# EAGLE board 85-2031 (EAGLE 6.6.0), part 1 of 2
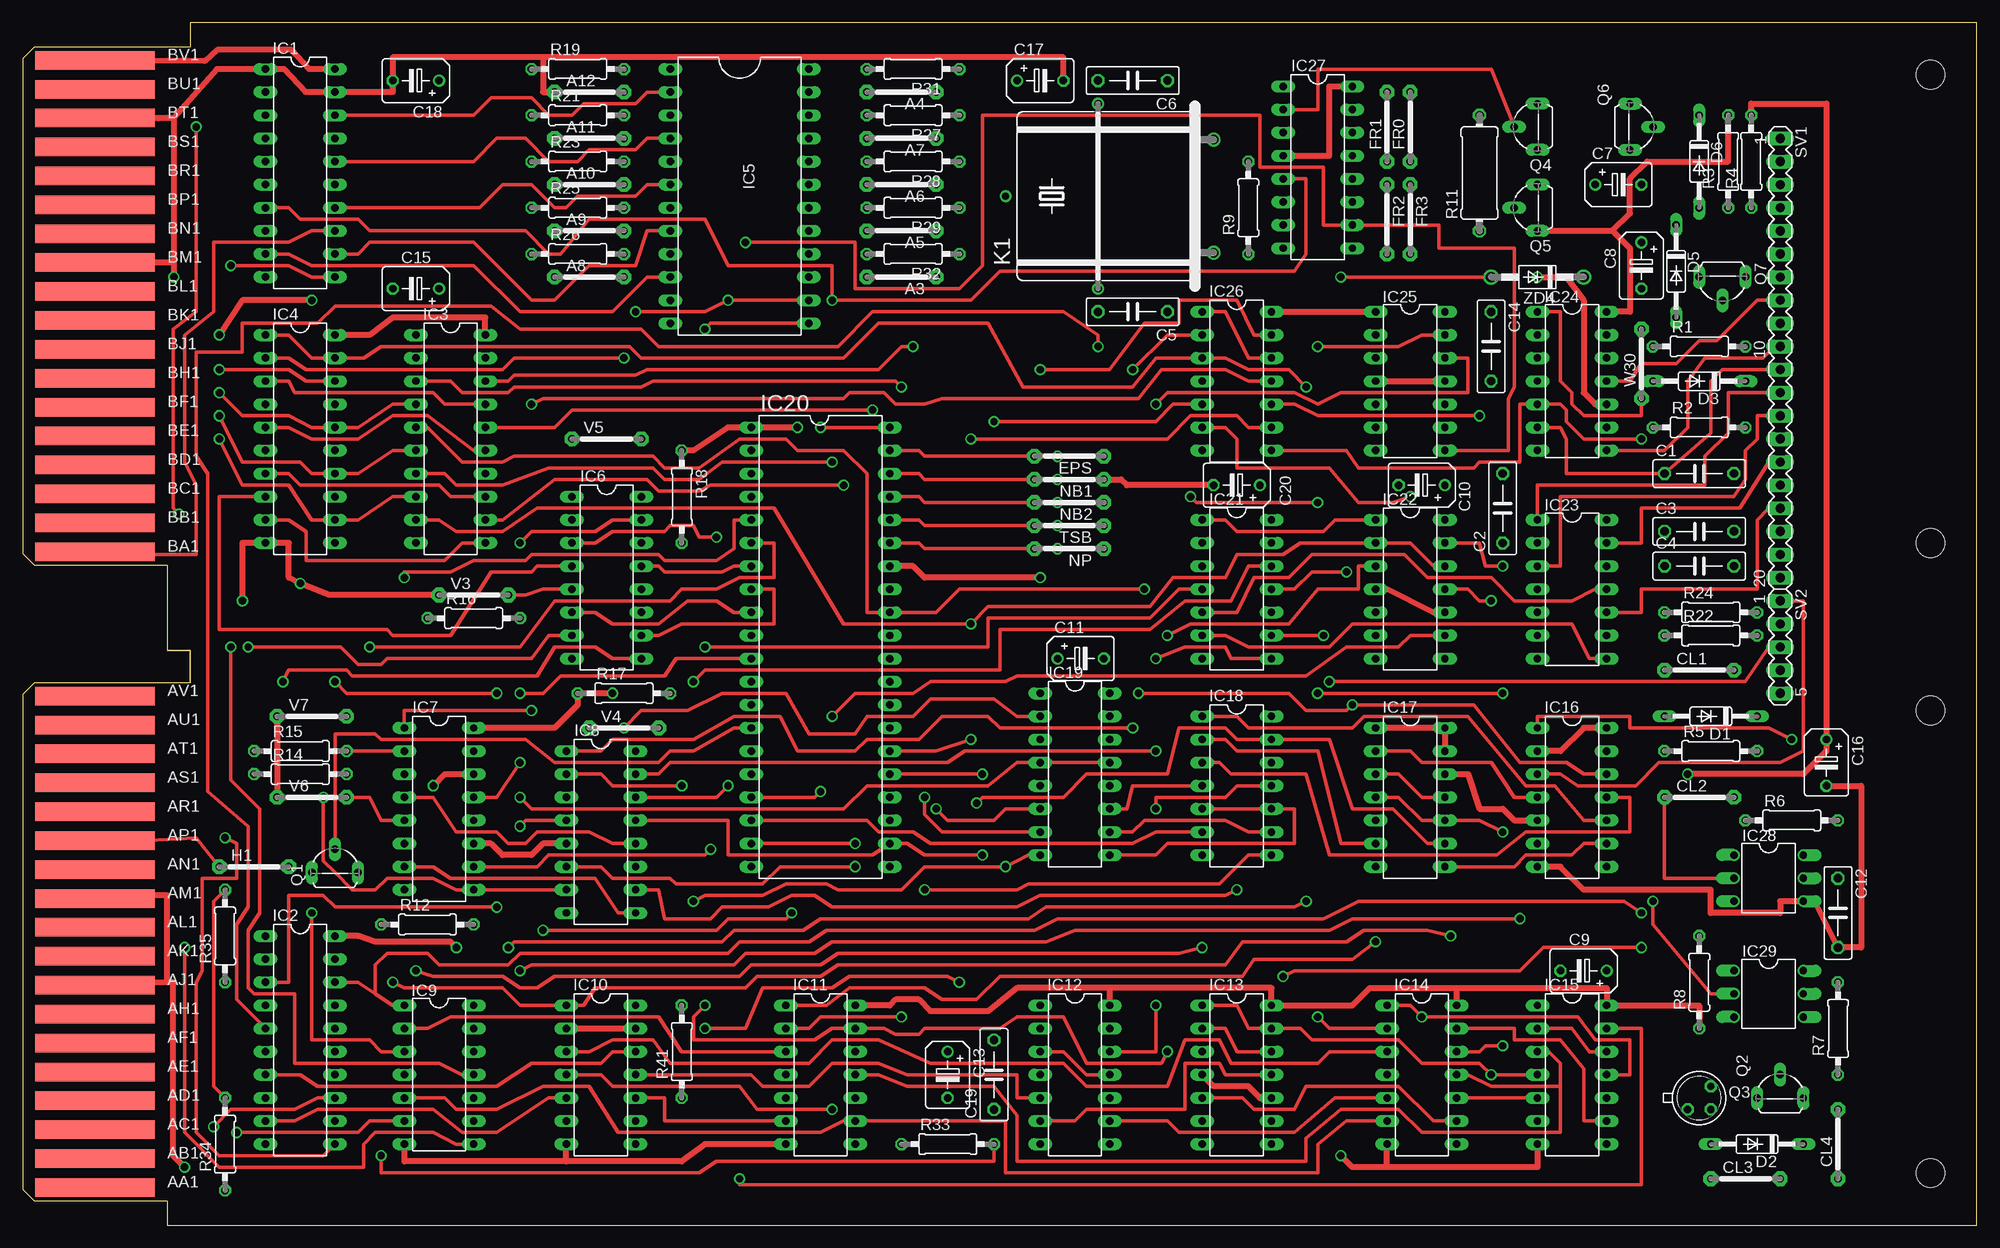
[diagram p2: board, top side]
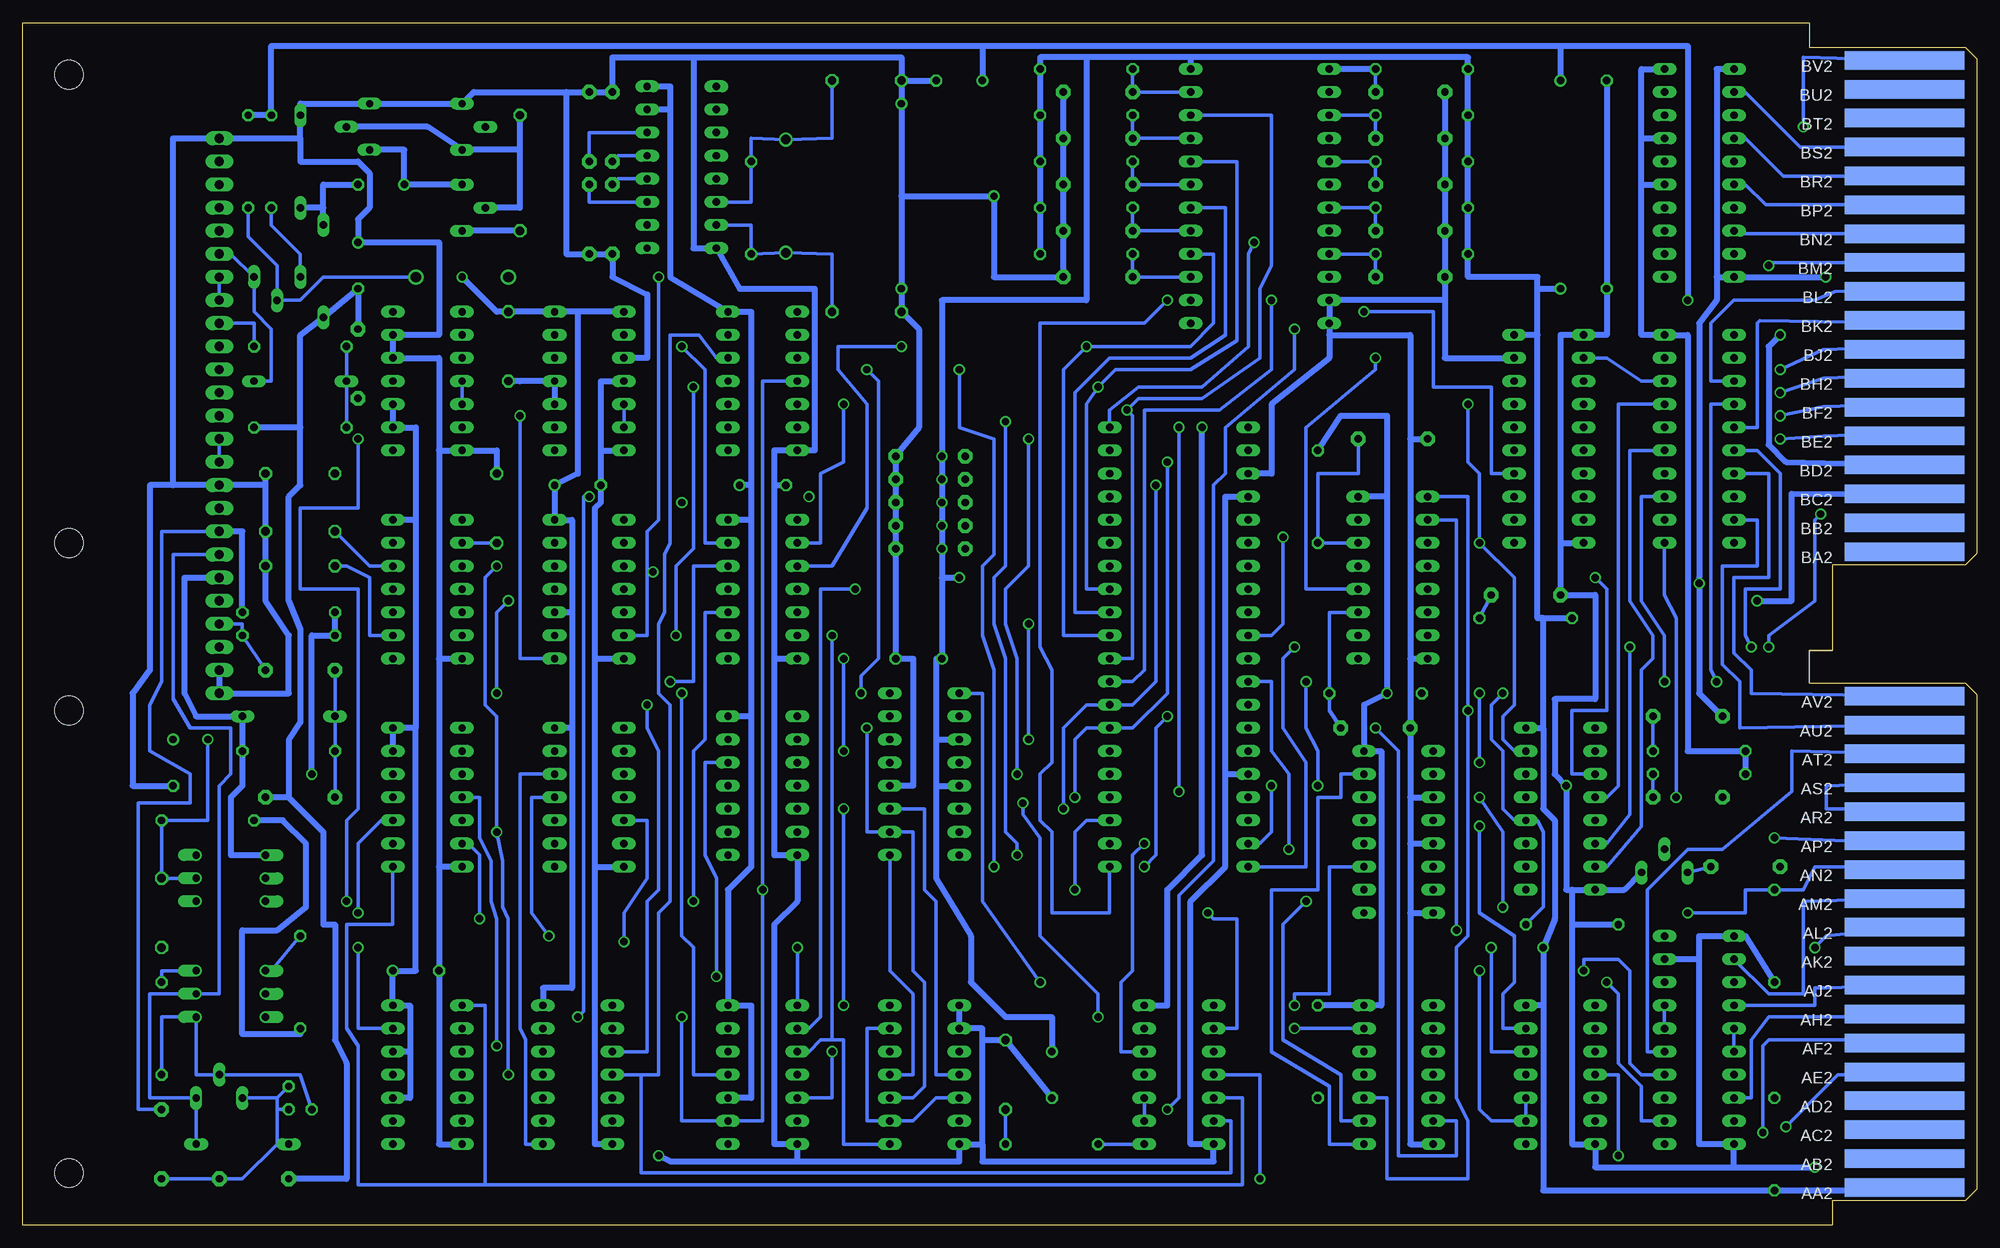
[diagram p3: board, bottom side, seen from below]

Size 214.63 x 132.08 mm. Coordinates in mm from the lower left corner, seen from the top.
Copper layers (1+16): Top 0.035mm / dielectric 1.5mm / Bottom 0.035mm
Design rules "16mils": minimum track width 16mil, minimum drill 32mil, track to track 15mil, track to pad 10mil, pad to pad 10mil, via to via 10mil, smd to smd 10mil, copper to edge 13mil, drill to drill 10mil, minimum pad ring 10mil, minimum via ring 8mil, stop-mask expansion 0mil, vias tented up to drill 0mil, thermal gap 10mil
Net classes: 1 Supply: width 0.635 mm

## Footprints (pad centres in the part's own frame; a part is rotated, then mirrored left to right if it is on the bottom)
07 = drill 0.813 pad 1.6 octagon: 1 -3.81,0; 2 3.81,0
C075-032X103 = drill 0.914 octagon: 1 -3.81,0; 2 3.81,0
B45181B = drill 0.813: + -2.54,0 | drill 0.813 octagon: - 2.54,0
DO35-10 = drill 0.813 long: A 5.08,0; C -5.08,0
DOUBLE-LONG = hole 3.175: 209.55,56.515; 209.55,5.715; 209.55,74.93; 209.55,126.365
EDGE-CON4 = smd 13.106 x 2.032: AA1 7.938,4.128; AB1 7.938,7.303; AC1 7.938,10.477; AD1 7.938,13.652; AE1 7.938,16.828; AF1 7.938,20.003; AH1 7.938,23.177; AJ1 7.938,26.352; AK1 7.938,29.527; AL1 7.938,32.703; AM1 7.938,35.877; AN1 7.938,39.053; AP1 7.938,42.227; AR1 7.938,45.403; AS1 7.938,48.578; AT1 7.938,51.752; AU1 7.938,54.928; AV1 7.938,58.102; BA1 7.938,73.978; BB1 7.938,77.153; BC1 7.938,80.328; BD1 7.938,83.502; BE1 7.938,86.677; BF1 7.938,89.853; BH1 7.938,93.028; BJ1 7.938,96.203; BK1 7.938,99.377; BL1 7.938,102.552; BM1 7.938,105.728; BN1 7.938,108.903; BP1 7.938,112.078; BR1 7.938,115.252; BS1 7.938,118.427; BT1 7.938,121.603; BU1 7.938,124.778; BV1 7.938,127.953 | smd 13.106 x 2.032 bottom: AA2 7.938,4.128; AB2 7.938,7.303; AC2 7.938,10.477; AD2 7.938,13.652; AE2 7.938,16.828; AF2 7.938,20.003; AH2 7.938,23.177; AJ2 7.938,26.352; AK2 7.938,29.527; AL2 7.938,32.703; AM2 7.938,35.877; AN2 7.938,39.053; AP2 7.938,42.227; AR2 7.938,45.403; AS2 7.938,48.578; AT2 7.938,51.752; AU2 7.938,54.928; AV2 7.938,58.102; BA2 7.938,73.978; BB2 7.938,77.153; BC2 7.938,80.328; BD2 7.938,83.502; BE2 7.938,86.677; BF2 7.938,89.853; BH2 7.938,93.028; BJ2 7.938,96.203; BK2 7.938,99.377; BL2 7.938,102.552; BM2 7.938,105.728; BN2 7.938,108.903; BP2 7.938,112.078; BR2 7.938,115.252; BS2 7.938,118.427; BT2 7.938,121.603; BU2 7.938,124.778; BV2 7.938,127.953
DIL20 = drill 0.813 long: 1 -11.43,-3.81; 2 -8.89,-3.81; 3 -6.35,-3.81; 4 -3.81,-3.81; 5 -1.27,-3.81; 6 1.27,-3.81; 7 3.81,-3.81; 8 6.35,-3.81; 9 8.89,-3.81; 10 11.43,-3.81; 11 11.43,3.81; 12 8.89,3.81; 13 6.35,3.81; 14 3.81,3.81; 15 1.27,3.81; 16 -1.27,3.81; 17 -3.81,3.81; 18 -6.35,3.81; 19 -8.89,3.81; 20 -11.43,3.81
DIL24 = drill 0.813 long: 1 -12.7,-7.62; 2 -10.16,-7.62; 3 -7.62,-7.62; 4 -5.08,-7.62; 5 -2.54,-7.62; 6 0,-7.62; 7 2.54,-7.62; 8 5.08,-7.62; 9 7.62,-7.62; 10 10.16,-7.62; 11 12.7,-7.62; 12 15.24,-7.62; 13 15.24,7.62; 14 12.7,7.62; 15 10.16,7.62; 16 7.62,7.62; 17 5.08,7.62; 18 2.54,7.62; 19 0,7.62; 20 -2.54,7.62; 21 -5.08,7.62; 22 -7.62,7.62; 23 -10.16,7.62; 24 -12.7,7.62
DIL16 = drill 0.813 long: 1 -8.89,-3.81; 2 -6.35,-3.81; 3 -3.81,-3.81; 4 -1.27,-3.81; 5 1.27,-3.81; 6 3.81,-3.81; 7 6.35,-3.81; 8 8.89,-3.81; 9 8.89,3.81; 10 6.35,3.81; 11 3.81,3.81; 12 1.27,3.81; 13 -1.27,3.81; 14 -3.81,3.81; 15 -6.35,3.81; 16 -8.89,3.81
DIL14 = drill 0.813 long: 1 -7.62,-3.81; 2 -5.08,-3.81; 3 -2.54,-3.81; 4 0,-3.81; 5 2.54,-3.81; 6 5.08,-3.81; 7 7.62,-3.81; 8 7.62,3.81; 9 5.08,3.81; 10 2.54,3.81; 11 0,3.81; 12 -2.54,3.81; 13 -5.08,3.81; 14 -7.62,3.81
DIL40 = drill 0.813 long: 1 -24.13,-7.62; 2 -21.59,-7.62; 3 -19.05,-7.62; 4 -16.51,-7.62; 5 -13.97,-7.62; 6 -11.43,-7.62; 7 -8.89,-7.62; 8 -6.35,-7.62; 9 -3.81,-7.62; 10 -1.27,-7.62; 11 1.27,-7.62; 12 3.81,-7.62; 13 6.35,-7.62; 14 8.89,-7.62; 15 11.43,-7.62; 16 13.97,-7.62; 17 16.51,-7.62; 18 19.05,-7.62; 19 21.59,-7.62; 20 24.13,-7.62; 21 24.13,7.62; 22 21.59,7.62; 23 19.05,7.62; 24 16.51,7.62; 25 13.97,7.62; 26 11.43,7.62; 27 8.89,7.62; 28 6.35,7.62; 29 3.81,7.62; 30 1.27,7.62; 31 -1.27,7.62; 32 -3.81,7.62; 33 -6.35,7.62; 34 -8.89,7.62; 35 -11.43,7.62; 36 -13.97,7.62; 37 -16.51,7.62; 38 -19.05,7.62; 39 -21.59,7.62; 40 -24.13,7.62
DIL06 = drill 0.813 offset: 1 -2.54,-3.81; 2 0,-3.81; 3 2.54,-3.81; 4 2.54,3.81; 5 0,3.81; 6 -2.54,3.81
HC33U-H = drill 1.016: 1 -6.223,-5.08; 2 6.223,-5.08 | drill 0.813: M -10.16,7.62; M1 10.16,7.62
TO92L = drill 0.813 long: 1 0,-2.54; 2 2.54,0; 3 0,2.54
TO18E = drill 0.813 octagon: D 1.27,-1.27; G 1.27,1.27; S -1.27,-1.27
0207/10 = drill 0.813 octagon: 1 -5.08,0; 2 5.08,0
0411/12 = drill 0.914 octagon: 1 -6.35,0; 2 6.35,0
MA20-1 = drill 1.016 long: 1 -24.13,0; 2 -21.59,0; 3 -19.05,0; 4 -16.51,0; 5 -13.97,0; 6 -11.43,0; 7 -8.89,0; 8 -6.35,0; 9 -3.81,0; 10 -1.27,0; 11 1.27,0; 12 3.81,0; 13 6.35,0; 14 8.89,0; 15 11.43,0; 16 13.97,0; 17 16.51,0; 18 19.05,0; 19 21.59,0; 20 24.13,0
MA05-1 = drill 1.016 long: 1 -5.08,0; 2 -2.54,0; 3 0,0; 4 2.54,0; 5 5.08,0
DO41Z10 = drill 1.118: A 5.08,0; C -5.08,0

## Placement (x,y rotation side)
A3  J7MM  [07]  96.52,104.14 180 top
A4  J7MM  [07]  96.52,124.46 180 top
A5  J7MM  [07]  96.52,109.22 180 top
A6  J7MM  [07]  96.52,114.3 180 top
A7  J7MM  [07]  96.52,119.38 180 top
A8  J7MM  [07]  62.23,104.14 0 top
A9  J7MM  [07]  62.23,109.22 0 top
A10  J7MM  [07]  62.23,114.3 0 top
A11  J7MM  [07]  62.23,119.38 0 top
A12  J7MM  [07]  62.23,124.46 0 top
C1  [C075-032X103]  184.15,82.55 0 top
C2  [C075-032X103]  162.56,78.74 90 top
C3  [C075-032X103]  184.15,76.2 0 top
C4  [C075-032X103]  184.15,72.39 0 top
C5  [C075-032X103]  121.92,100.33 180 top
C6  [C075-032X103]  121.92,125.73 180 top
C7  [B45181B]  175.26,114.3 0 top
C8  [B45181B]  177.8,105.41 270 top
C9  [B45181B]  171.45,27.94 180 top
C10  [B45181B]  153.67,81.28 180 top
C11  [B45181B]  116.21,62.23 0 top
C12  [C075-032X103]  199.39,34.29 270 top
C13  [B45181B]  101.6,16.51 270 top
C14  [C075-032X103]  161.29,96.52 270 top
C15  [B45181B]  43.18,102.87 180 top
C16  [B45181B]  198.12,50.8 270 top
C17  [B45181B]  111.76,125.73 0 top
C18  [B45181B]  43.18,125.73 180 top
C19  [C075-032X103]  106.68,16.51 90 top
C20  [B45181B]  133.35,81.28 180 top
CL1  [07]  184.15,60.96 0 top
CL2  [07]  184.15,46.99 0 top
CL3  [07]  189.23,5.08 0 top
CL4  [07]  199.39,8.89 90 top
D1  1N4149  [DO35-10]  185.42,55.88 180 top
D2  1N4149  [DO35-10]  190.5,8.89 180 top
D3  1N4149  [DO35-10]  184.15,92.71 180 top
D5  1N4149  [DO35-10]  181.61,104.78 270 top
D6  1N4149  [DO35-10]  184.15,116.84 270 top
E$2  [DOUBLE-LONG]  0,0 0 top
EDGE$  [EDGE-CON4]  0,0 0 top
EPS  [07]  114.94,84.45 180 top
FR0  [07]  152.4,120.65 90 top
FR1  [07]  149.86,120.65 90 top
FR2  [07]  149.86,110.49 270 top
FR3  [07]  152.4,110.49 270 top
H1  J7MM  [07]  25.4,39.37 0 top
IC1  74LS240N  [DIL20]  30.48,115.57 270 top
IC2  74LS240N  [DIL20]  30.48,20.32 270 top
IC3  74LS240N  [DIL20]  46.99,86.36 270 top
IC4  74S240N  [DIL20]  30.48,86.36 270 top
IC5  8130  [DIL24]  78.74,114.3 270 top
IC6  74LS157N  [DIL16]  64.14,71.12 270 top
IC7  74LS257N  [DIL16]  45.72,45.72 270 top
IC8  74LS257N  [DIL16]  63.5,43.18 270 top
IC9  7438N  [DIL14]  45.72,16.51 270 top
IC10  74LS00N  [DIL14]  63.5,16.51 270 top
IC11  74LS08N  [DIL14]  87.63,16.51 270 top
IC12  74LS27N  [DIL14]  115.57,16.51 270 top
IC13  74LS74N  [DIL14]  133.35,16.51 270 top
IC14  74LS10N  [DIL14]  153.67,16.51 270 top
IC15  74LS74N  [DIL14]  170.18,16.51 270 top
IC16  74LS00N  [DIL14]  170.18,46.99 270 top
IC17  74LS74N  [DIL14]  152.4,46.99 270 top
IC18  74LS10N  [DIL14]  133.35,48.26 270 top
IC19  74LS75N  [DIL16]  115.57,49.53 270 top
IC20  6402  [DIL40]  87.63,63.5 270 top
IC21  74LS02N  [DIL14]  133.35,69.85 270 top
IC22  74LS74N  [DIL14]  152.4,69.85 270 top
IC23  1489N  [DIL14]  170.18,69.85 270 top
IC24  1488N  [DIL14]  170.18,92.71 270 top
IC25  74LS196  [DIL14]  152.4,92.71 270 top
IC26  74LS08N  [DIL14]  133.35,92.71 270 top
IC27  4702  [DIL16]  142.24,116.2 270 top
IC28  4N26  [DIL06]  191.77,38.1 270 top
IC29  4N26  [DIL06]  191.77,25.4 270 top
K1  2.4576Mhz  [HC33U-H]  125.73,113.03 90 top
NB1  [07]  114.94,81.92 180 top
NB2  [07]  114.94,79.38 180 top
NP  [07]  114.94,74.3 180 top
Q1  MPSA06  [TO92L]  34.29,38.73 90 top
Q2  MPSA55  [TO92L]  193.04,13.97 90 top
Q3  NCh, 30V, 1.5mA  [TO18E]  184.15,13.97 0 top
Q4  MPSA06  [TO92L]  166.37,120.65 180 top
Q5  MPSA06  [TO92L]  166.37,111.76 180 top
Q6  MPSA55  [TO92L]  176.53,120.65 0 top
Q7  MPSA55  [TO92L]  186.69,104.14 270 top
R1  [0207/10]  184.15,96.52 0 top
R2  [0207/10]  184.15,87.63 0 top
R3  [0207/10]  187.33,116.84 90 top
R4  [0207/10]  189.87,116.84 90 top
R5  [0207/10]  185.42,52.07 0 top
R6  [0207/10]  194.31,44.45 0 top
R7  [0207/10]  199.39,21.59 90 top
R8  [0207/10]  184.15,26.67 90 top
R9  [0207/10]  134.62,111.76 90 top
R11  [0411/12]  160.02,115.57 90 top
R12  [0207/10]  44.45,33.02 0 top
R14  [0207/10]  30.48,49.53 0 top
R15  [0207/10]  30.48,52.07 0 top
R16  [0207/10]  49.53,66.67 0 top
R17  [0207/10]  66.04,58.42 0 top
R18  [0207/10]  72.39,80.01 270 top
R19  [0207/10]  60.96,127 0 top
R21  [0207/10]  60.96,121.92 0 top
R22  [0207/10]  185.42,64.77 0 top
R23  [0207/10]  60.96,116.84 0 top
R24  [0207/10]  185.42,67.31 0 top
R25  [0207/10]  60.96,111.76 0 top
R26  [0207/10]  60.96,106.68 0 top
R27  [0207/10]  97.79,121.92 180 top
R28  [0207/10]  97.79,116.84 180 top
R29  [0207/10]  97.79,111.76 180 top
R31  [0207/10]  97.79,127 180 top
R32  [0207/10]  97.79,106.68 180 top
R33  [0207/10]  101.6,8.89 0 top
R34  [0207/10]  22.23,8.89 90 top
R35  [0207/10]  22.23,31.75 90 top
R41  [0207/10]  72.39,19.05 90 top
SV1  [MA20-1]  193.04,95.25 270 top
SV2  [MA05-1]  193.04,63.5 270 top
TSB  [07]  114.94,76.83 180 top
V3  [07]  49.53,69.22 0 top
V4  [07]  66.04,54.61 0 top
V5  [07]  64.14,86.36 0 top
V6  [07]  31.75,46.99 0 top
V7  [07]  31.75,55.88 0 top
W30  [07]  177.8,94.61 90 top
ZD4  1N4738A  [DO41Z10]  166.37,104.14 180 top